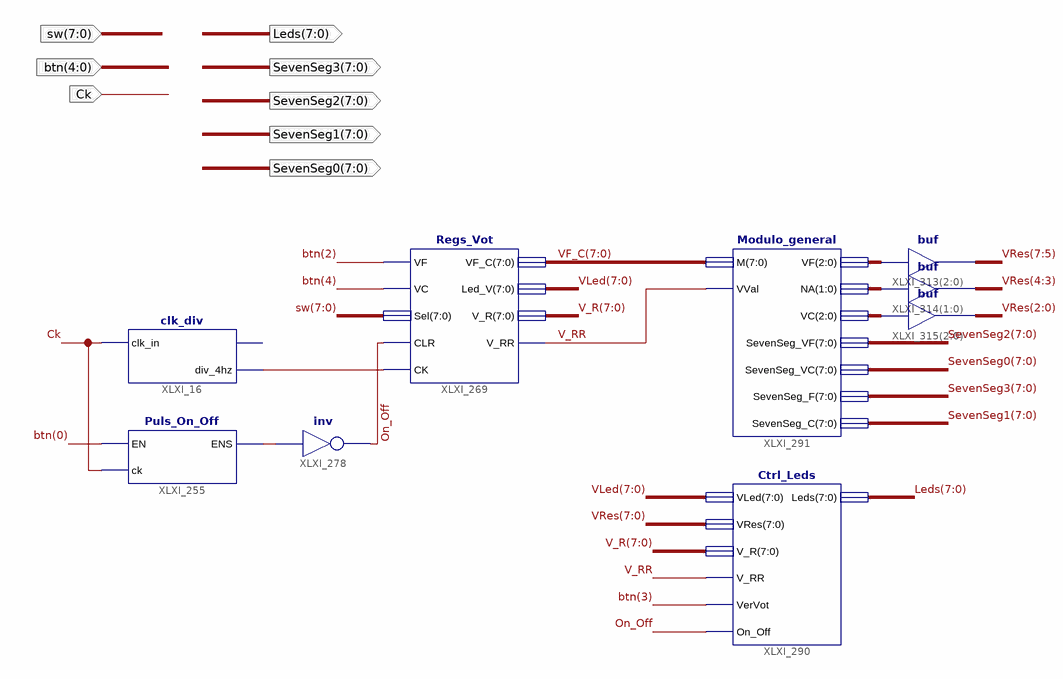
[diagram p0: schematic sheet 1]
// Xilinx ISE schematic MyDesign.sch (spartan6) as structural Verilog: 9 symbols, 8 ports
module MyDesign (
  input  [7:0] sw,
  input  [4:0] btn,
  input  Ck,
  output [7:0] Leds,
  output [7:0] SevenSeg3,
  output [7:0] SevenSeg2,
  output [7:0] SevenSeg1,
  output [7:0] SevenSeg0
);

  wire On_Off, V_RR, XLXN_7, XLXN_134;
  wire [1:0] XLXN_172;
  wire [2:0] XLXN_171, XLXN_173;
  wire [7:0] V_R, VF_C, VLed, VRes;

  clk_div XLXI_16 (.clk_in(Ck), .div_4hz(XLXN_7));  // open: div_1hz
  Puls_On_Off XLXI_255 (.ck(Ck), .EN(btn[0]), .ENS(XLXN_134));
  not XLXI_278 (On_Off, XLXN_134);
  Ctrl_Leds XLXI_290 (.Leds(Leds), .On_Off(On_Off), .VerVot(btn[3]), .VLed(VLed), .VRes(VRes), .V_R(V_R), .V_RR(V_RR));
  Regs_Vot XLXI_269 (
    .CK(XLXN_7), .CLR(On_Off), .Led_V(VLed), .Sel(sw), .VC(btn[4]), .VF(btn[2]), .VF_C(VF_C), .V_R(V_R),
    .V_RR(V_RR));
  Modulo_general XLXI_291 (
    .M(VF_C), .NA(XLXN_172), .SevenSeg_C(SevenSeg1), .SevenSeg_F(SevenSeg3), .SevenSeg_VC(SevenSeg0),
    .SevenSeg_VF(SevenSeg2), .VC(XLXN_173), .VF(XLXN_171), .VVal(V_RR));
  assign VRes[7:5] = XLXN_171;  // buf XLXI_313[2..0], 3 bits wide
  assign VRes[4:3] = XLXN_172;  // buf XLXI_314[1..0], 2 bits wide
  assign VRes[2:0] = XLXN_173;  // buf XLXI_315[2..0], 3 bits wide
endmodule
